# Altium schematic sheet Э3-7.SchDoc
size 594 x 420 mm; Address1: Address1; Address2: Address2; Address3: Address3; Address4: Address4; SheetNumber: 7; SheetTotal: 12; DocumentType: Схема электрическая принципиальная
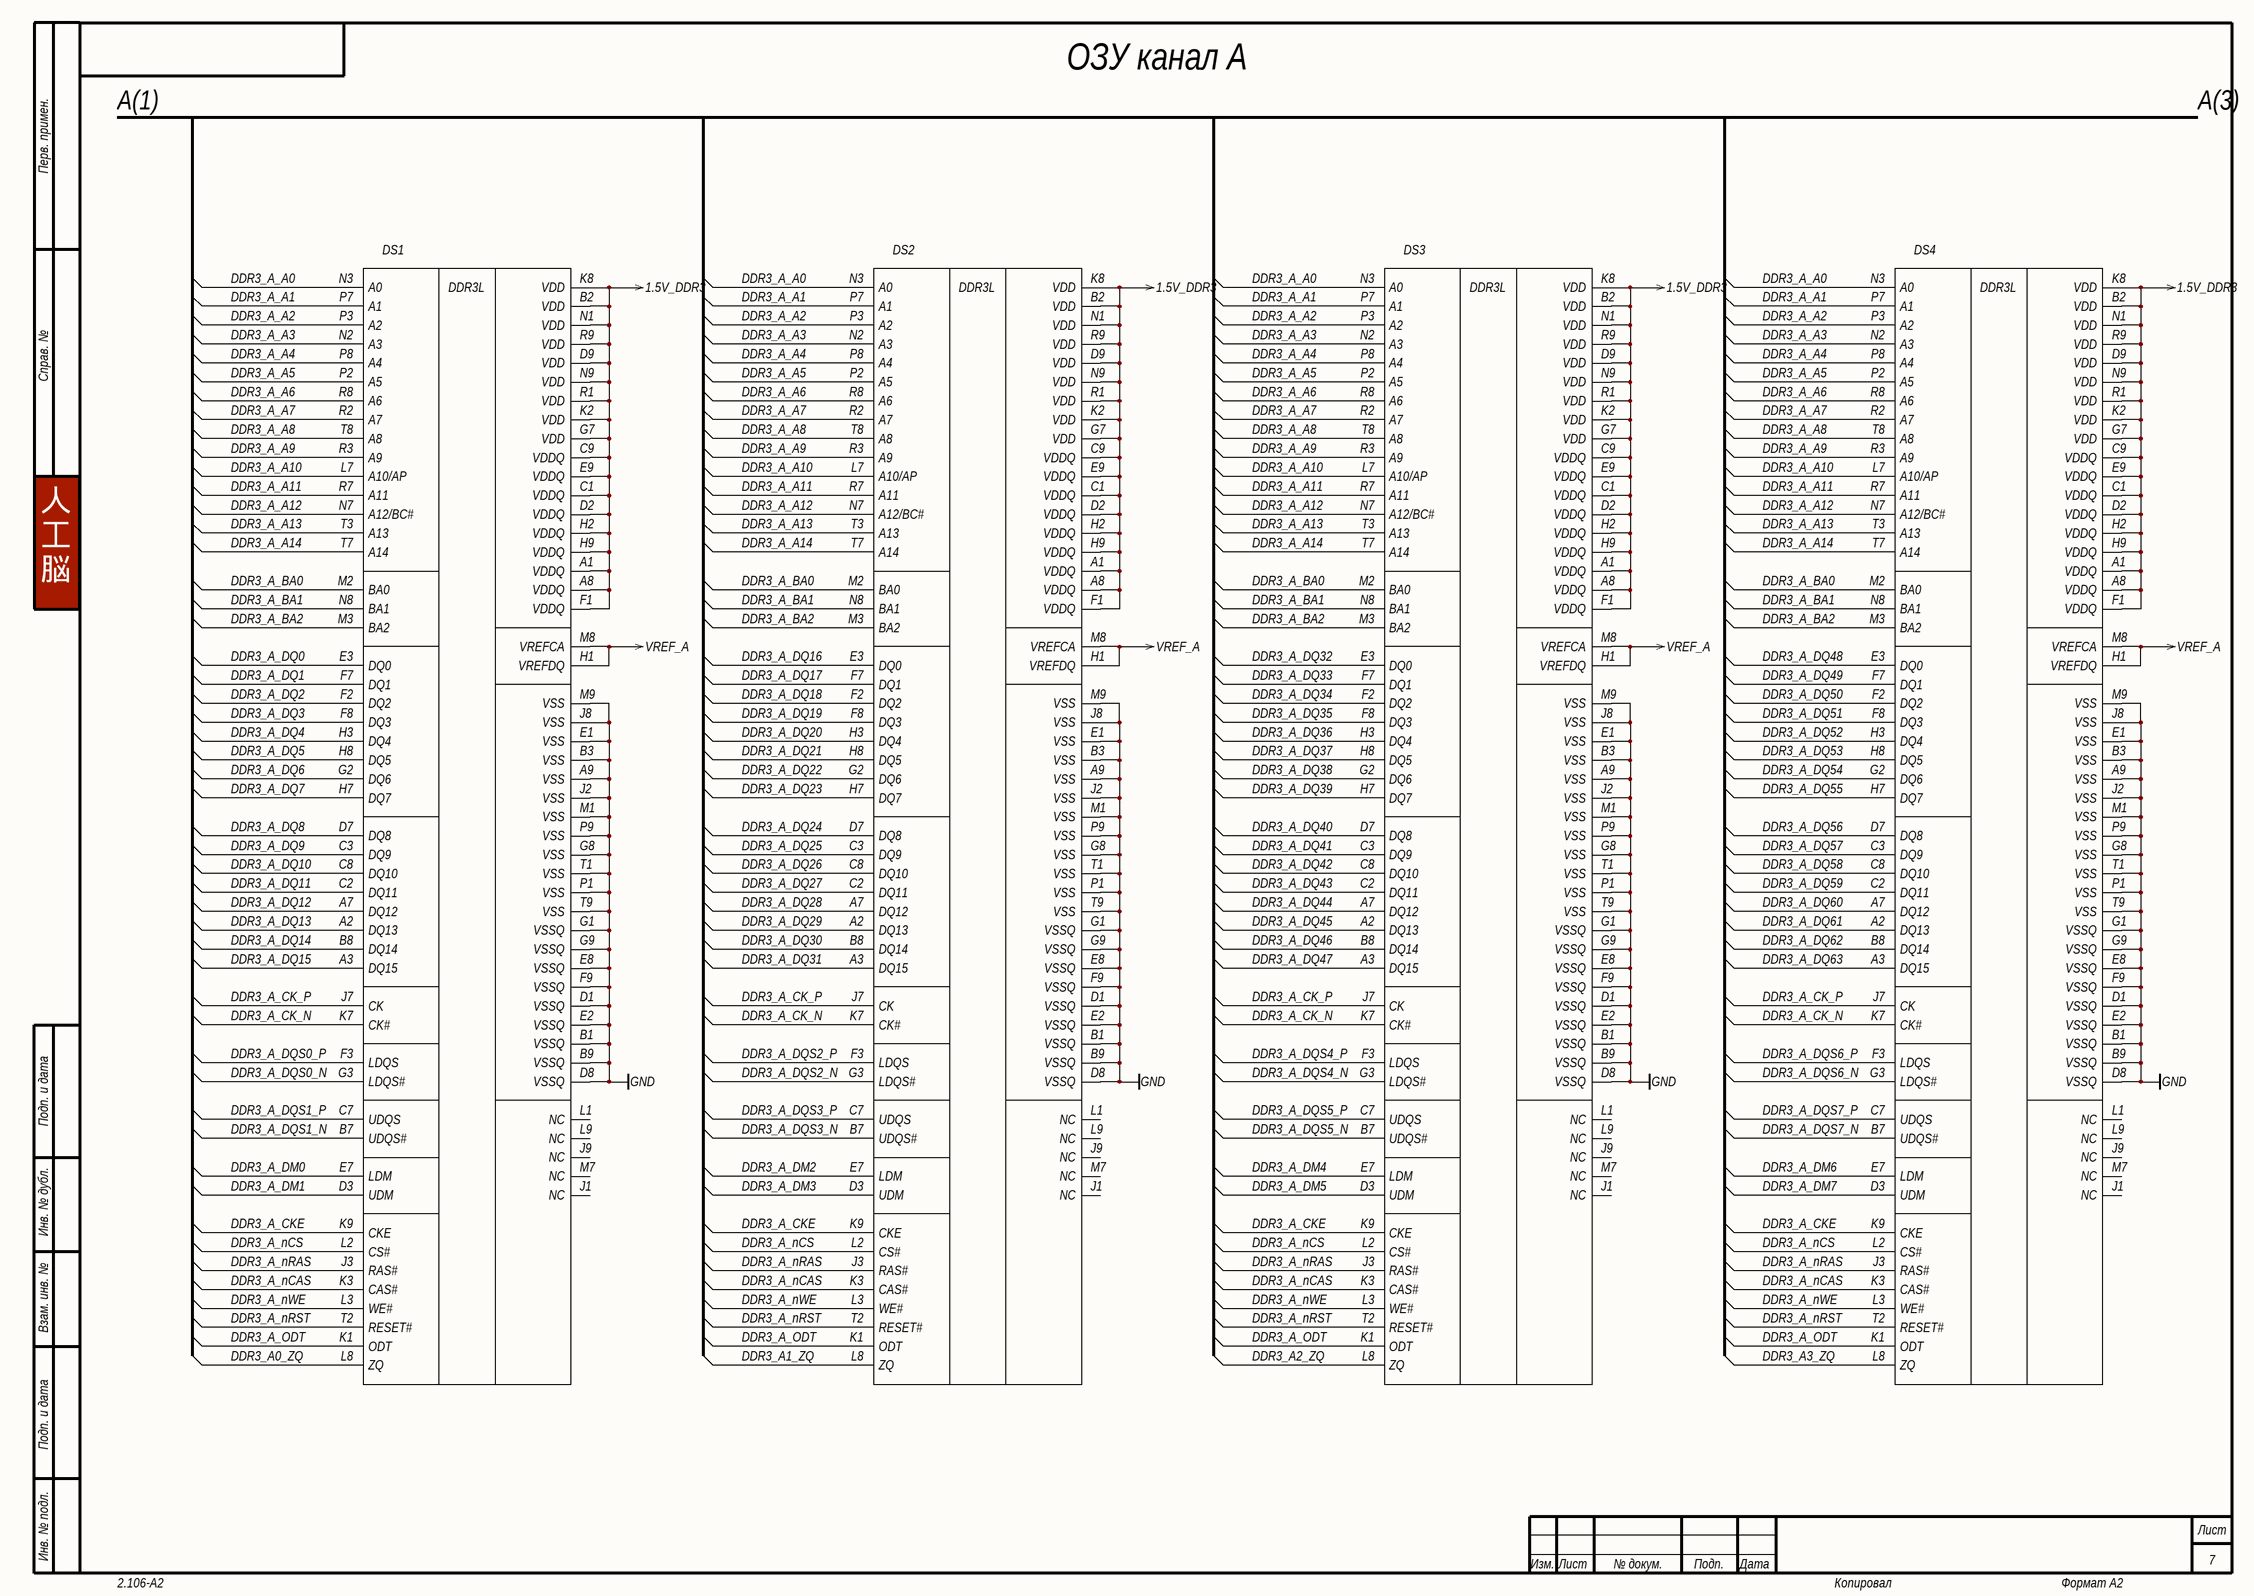
[diagram p0: Э3-7.SchDoc]

## Parts
DS1  1  [96-FBGA]  (value not drawn)
DS2  1  [96-FBGA]  (value not drawn)
DS3  1  [96-FBGA]  (value not drawn)
DS4  1  [96-FBGA]  (value not drawn)

## Nets
1.5V_DDR3: DS1.A1(VDDQ) DS1.A8(VDDQ) DS1.B2(VDD) DS1.C1(VDDQ) DS1.C9(VDDQ) DS1.D2(VDDQ) DS1.D9(VDD) DS1.E9(VDDQ) DS1.F1(VDDQ) DS1.G7(VDD) DS1.H2(VDDQ) DS1.H9(VDDQ) DS1.K2(VDD) DS1.K8(VDD) DS1.N1(VDD) DS1.N9(VDD) DS1.R1(VDD) DS1.R9(VDD) DS2.A1(VDDQ) DS2.A8(VDDQ) DS2.B2(VDD) DS2.C1(VDDQ) DS2.C9(VDDQ) DS2.D2(VDDQ) DS2.D9(VDD) DS2.E9(VDDQ) DS2.F1(VDDQ) DS2.G7(VDD) DS2.H2(VDDQ) DS2.H9(VDDQ) DS2.K2(VDD) DS2.K8(VDD) DS2.N1(VDD) DS2.N9(VDD) DS2.R1(VDD) DS2.R9(VDD) DS3.A1(VDDQ) DS3.A8(VDDQ) DS3.B2(VDD) DS3.C1(VDDQ) DS3.C9(VDDQ) DS3.D2(VDDQ) DS3.D9(VDD) DS3.E9(VDDQ) DS3.F1(VDDQ) DS3.G7(VDD) DS3.H2(VDDQ) DS3.H9(VDDQ) DS3.K2(VDD) DS3.K8(VDD) DS3.N1(VDD) DS3.N9(VDD) DS3.R1(VDD) DS3.R9(VDD) DS4.A1(VDDQ) DS4.A8(VDDQ) DS4.B2(VDD) DS4.C1(VDDQ) DS4.C9(VDDQ) DS4.D2(VDDQ) DS4.D9(VDD) DS4.E9(VDDQ) DS4.F1(VDDQ) DS4.G7(VDD) DS4.H2(VDDQ) DS4.H9(VDDQ) DS4.K2(VDD) DS4.K8(VDD) DS4.N1(VDD) DS4.N9(VDD) DS4.R1(VDD) DS4.R9(VDD)
GND: DS1.A9(VSS) DS1.B1(VSSQ) DS1.B3(VSS) DS1.B9(VSSQ) DS1.D1(VSSQ) DS1.D8(VSSQ) DS1.E1(VSS) DS1.E2(VSSQ) DS1.E8(VSSQ) DS1.F9(VSSQ) DS1.G1(VSSQ) DS1.G8(VSS) DS1.G9(VSSQ) DS1.J2(VSS) DS1.J8(VSS) DS1.M1(VSS) DS1.M9(VSS) DS1.P1(VSS) DS1.P9(VSS) DS1.T1(VSS) DS1.T9(VSS) DS2.A9(VSS) DS2.B1(VSSQ) DS2.B3(VSS) DS2.B9(VSSQ) DS2.D1(VSSQ) DS2.D8(VSSQ) DS2.E1(VSS) DS2.E2(VSSQ) DS2.E8(VSSQ) DS2.F9(VSSQ) DS2.G1(VSSQ) DS2.G8(VSS) DS2.G9(VSSQ) DS2.J2(VSS) DS2.J8(VSS) DS2.M1(VSS) DS2.M9(VSS) DS2.P1(VSS) DS2.P9(VSS) DS2.T1(VSS) DS2.T9(VSS) DS3.A9(VSS) DS3.B1(VSSQ) DS3.B3(VSS) DS3.B9(VSSQ) DS3.D1(VSSQ) DS3.D8(VSSQ) DS3.E1(VSS) DS3.E2(VSSQ) DS3.E8(VSSQ) DS3.F9(VSSQ) DS3.G1(VSSQ) DS3.G8(VSS) DS3.G9(VSSQ) DS3.J2(VSS) DS3.J8(VSS) DS3.M1(VSS) DS3.M9(VSS) DS3.P1(VSS) DS3.P9(VSS) DS3.T1(VSS) DS3.T9(VSS) DS4.A9(VSS) DS4.B1(VSSQ) DS4.B3(VSS) DS4.B9(VSSQ) DS4.D1(VSSQ) DS4.D8(VSSQ) DS4.E1(VSS) DS4.E2(VSSQ) DS4.E8(VSSQ) DS4.F9(VSSQ) DS4.G1(VSSQ) DS4.G8(VSS) DS4.G9(VSSQ) DS4.J2(VSS) DS4.J8(VSS) DS4.M1(VSS) DS4.M9(VSS) DS4.P1(VSS) DS4.P9(VSS) DS4.T1(VSS) DS4.T9(VSS)
VREF_A: DS1.H1(VREFDQ) DS1.M8(VREFCA) DS2.H1(VREFDQ) DS2.M8(VREFCA) DS3.H1(VREFDQ) DS3.M8(VREFCA) DS4.H1(VREFDQ) DS4.M8(VREFCA)
DDR3_A0_ZQ: DS1.L8(ZQ)
DDR3_A1_ZQ: DS2.L8(ZQ)
DDR3_A2_ZQ: DS3.L8(ZQ)
DDR3_A3_ZQ: DS4.L8(ZQ)
DDR3_A_A0: DS1.N3(A0) DS2.N3(A0) DS3.N3(A0) DS4.N3(A0)
DDR3_A_A1: DS1.P7(A1) DS2.P7(A1) DS3.P7(A1) DS4.P7(A1)
DDR3_A_A2: DS1.P3(A2) DS2.P3(A2) DS3.P3(A2) DS4.P3(A2)
DDR3_A_A3: DS1.N2(A3) DS2.N2(A3) DS3.N2(A3) DS4.N2(A3)
DDR3_A_A4: DS1.P8(A4) DS2.P8(A4) DS3.P8(A4) DS4.P8(A4)
DDR3_A_A5: DS1.P2(A5) DS2.P2(A5) DS3.P2(A5) DS4.P2(A5)
DDR3_A_A6: DS1.R8(A6) DS2.R8(A6) DS3.R8(A6) DS4.R8(A6)
DDR3_A_A7: DS1.R2(A7) DS2.R2(A7) DS3.R2(A7) DS4.R2(A7)
DDR3_A_A8: DS1.T8(A8) DS2.T8(A8) DS3.T8(A8) DS4.T8(A8)
DDR3_A_A9: DS1.R3(A9) DS2.R3(A9) DS3.R3(A9) DS4.R3(A9)
DDR3_A_A10: DS1.L7(A10/AP) DS2.L7(A10/AP) DS3.L7(A10/AP) DS4.L7(A10/AP)
DDR3_A_A11: DS1.R7(A11) DS2.R7(A11) DS3.R7(A11) DS4.R7(A11)
DDR3_A_A12: DS1.N7(A12/BC#) DS2.N7(A12/BC#) DS3.N7(A12/BC#) DS4.N7(A12/BC#)
DDR3_A_A13: DS1.T3(A13) DS2.T3(A13) DS3.T3(A13) DS4.T3(A13)
DDR3_A_A14: DS1.T7(A14) DS2.T7(A14) DS3.T7(A14) DS4.T7(A14)
DDR3_A_BA0: DS1.M2(BA0) DS2.M2(BA0) DS3.M2(BA0) DS4.M2(BA0)
DDR3_A_BA1: DS1.N8(BA1) DS2.N8(BA1) DS3.N8(BA1) DS4.N8(BA1)
DDR3_A_BA2: DS1.M3(BA2) DS2.M3(BA2) DS3.M3(BA2) DS4.M3(BA2)
DDR3_A_CK_N: DS1.K7(CK#) DS2.K7(CK#) DS3.K7(CK#) DS4.K7(CK#)
DDR3_A_CK_P: DS1.J7(CK) DS2.J7(CK) DS3.J7(CK) DS4.J7(CK)
DDR3_A_CKE: DS1.K9(CKE) DS2.K9(CKE) DS3.K9(CKE) DS4.K9(CKE)
DDR3_A_DM0: DS1.E7(LDM)
DDR3_A_DM1: DS1.D3(UDM)
DDR3_A_DM2: DS2.E7(LDM)
DDR3_A_DM3: DS2.D3(UDM)
DDR3_A_DM4: DS3.E7(LDM)
DDR3_A_DM5: DS3.D3(UDM)
DDR3_A_DM6: DS4.E7(LDM)
DDR3_A_DM7: DS4.D3(UDM)
DDR3_A_DQ0: DS1.E3(DQ0)
DDR3_A_DQ1: DS1.F7(DQ1)
DDR3_A_DQ2: DS1.F2(DQ2)
DDR3_A_DQ3: DS1.F8(DQ3)
DDR3_A_DQ4: DS1.H3(DQ4)
DDR3_A_DQ5: DS1.H8(DQ5)
DDR3_A_DQ6: DS1.G2(DQ6)
DDR3_A_DQ7: DS1.H7(DQ7)
DDR3_A_DQ8: DS1.D7(DQ8)
DDR3_A_DQ9: DS1.C3(DQ9)
DDR3_A_DQ10: DS1.C8(DQ10)
DDR3_A_DQ11: DS1.C2(DQ11)
DDR3_A_DQ12: DS1.A7(DQ12)
DDR3_A_DQ13: DS1.A2(DQ13)
DDR3_A_DQ14: DS1.B8(DQ14)
DDR3_A_DQ15: DS1.A3(DQ15)
DDR3_A_DQ16: DS2.E3(DQ0)
DDR3_A_DQ17: DS2.F7(DQ1)
DDR3_A_DQ18: DS2.F2(DQ2)
DDR3_A_DQ19: DS2.F8(DQ3)
DDR3_A_DQ20: DS2.H3(DQ4)
DDR3_A_DQ21: DS2.H8(DQ5)
DDR3_A_DQ22: DS2.G2(DQ6)
DDR3_A_DQ23: DS2.H7(DQ7)
DDR3_A_DQ24: DS2.D7(DQ8)
DDR3_A_DQ25: DS2.C3(DQ9)
DDR3_A_DQ26: DS2.C8(DQ10)
DDR3_A_DQ27: DS2.C2(DQ11)
DDR3_A_DQ28: DS2.A7(DQ12)
DDR3_A_DQ29: DS2.A2(DQ13)
DDR3_A_DQ30: DS2.B8(DQ14)
DDR3_A_DQ31: DS2.A3(DQ15)
DDR3_A_DQ32: DS3.E3(DQ0)
DDR3_A_DQ33: DS3.F7(DQ1)
DDR3_A_DQ34: DS3.F2(DQ2)
DDR3_A_DQ35: DS3.F8(DQ3)
DDR3_A_DQ36: DS3.H3(DQ4)
DDR3_A_DQ37: DS3.H8(DQ5)
DDR3_A_DQ38: DS3.G2(DQ6)
DDR3_A_DQ39: DS3.H7(DQ7)
DDR3_A_DQ40: DS3.D7(DQ8)
DDR3_A_DQ41: DS3.C3(DQ9)
DDR3_A_DQ42: DS3.C8(DQ10)
DDR3_A_DQ43: DS3.C2(DQ11)
DDR3_A_DQ44: DS3.A7(DQ12)
DDR3_A_DQ45: DS3.A2(DQ13)
DDR3_A_DQ46: DS3.B8(DQ14)
DDR3_A_DQ47: DS3.A3(DQ15)
DDR3_A_DQ48: DS4.E3(DQ0)
DDR3_A_DQ49: DS4.F7(DQ1)
DDR3_A_DQ50: DS4.F2(DQ2)
DDR3_A_DQ51: DS4.F8(DQ3)
DDR3_A_DQ52: DS4.H3(DQ4)
DDR3_A_DQ53: DS4.H8(DQ5)
DDR3_A_DQ54: DS4.G2(DQ6)
DDR3_A_DQ55: DS4.H7(DQ7)
DDR3_A_DQ56: DS4.D7(DQ8)
DDR3_A_DQ57: DS4.C3(DQ9)
DDR3_A_DQ58: DS4.C8(DQ10)
DDR3_A_DQ59: DS4.C2(DQ11)
DDR3_A_DQ60: DS4.A7(DQ12)
DDR3_A_DQ61: DS4.A2(DQ13)
DDR3_A_DQ62: DS4.B8(DQ14)
DDR3_A_DQ63: DS4.A3(DQ15)
DDR3_A_DQS0_N: DS1.G3(LDQS#)
DDR3_A_DQS0_P: DS1.F3(LDQS)
DDR3_A_DQS1_N: DS1.B7(UDQS#)
DDR3_A_DQS1_P: DS1.C7(UDQS)
DDR3_A_DQS2_N: DS2.G3(LDQS#)
DDR3_A_DQS2_P: DS2.F3(LDQS)
DDR3_A_DQS3_N: DS2.B7(UDQS#)
DDR3_A_DQS3_P: DS2.C7(UDQS)
DDR3_A_DQS4_N: DS3.G3(LDQS#)
DDR3_A_DQS4_P: DS3.F3(LDQS)
DDR3_A_DQS5_N: DS3.B7(UDQS#)
DDR3_A_DQS5_P: DS3.C7(UDQS)
DDR3_A_DQS6_N: DS4.G3(LDQS#)
DDR3_A_DQS6_P: DS4.F3(LDQS)
DDR3_A_DQS7_N: DS4.B7(UDQS#)
DDR3_A_DQS7_P: DS4.C7(UDQS)
DDR3_A_nCAS: DS1.K3(CAS#) DS2.K3(CAS#) DS3.K3(CAS#) DS4.K3(CAS#)
DDR3_A_nCS: DS1.L2(CS#) DS2.L2(CS#) DS3.L2(CS#) DS4.L2(CS#)
DDR3_A_nRAS: DS1.J3(RAS#) DS2.J3(RAS#) DS3.J3(RAS#) DS4.J3(RAS#)
DDR3_A_nRST: DS1.T2(RESET#) DS2.T2(RESET#) DS3.T2(RESET#) DS4.T2(RESET#)
DDR3_A_nWE: DS1.L3(WE#) DS2.L3(WE#) DS3.L3(WE#) DS4.L3(WE#)
DDR3_A_ODT: DS1.K1(ODT) DS2.K1(ODT) DS3.K1(ODT) DS4.K1(ODT)

Not connected (* = marked no-connect by the designer): DS1 J1(NC) J9(NC) L1(NC) L9(NC) M7(NC); DS2 J1(NC) J9(NC) L1(NC) L9(NC) M7(NC); DS3 J1(NC) J9(NC) L1(NC) L9(NC) M7(NC); DS4 J1(NC) J9(NC) L1(NC) L9(NC) M7(NC)

## Notes on the sheet
- A(1)
- ОЗУ канал A
- A(3)
- 人
  工
  脳
- Перв. примен.
- Справ. №
- Подп. и дата
- Инв. № дубл.
- Взам. инв. №
- Инв. № подл.
- Изм.
- Лист
- № докум.
- Подп.
- Дата
- 2.106-A2
- Копировал
- Формат А2
- (in symbol MT41K256M16TW-107IT:P) DDR3L

## Library data of the parts
DS1-DS4 = MT41K256M16TW-107IT:P: 32 Megx16x8 banks DDR3L SDRAM; Manufacturer: Micron Technology, Inc.; TemperatureRange: -...+°C; ComponentType: Микросхема; Install: 1